# EAGLE design CertStack (EAGLE 9.5.1)
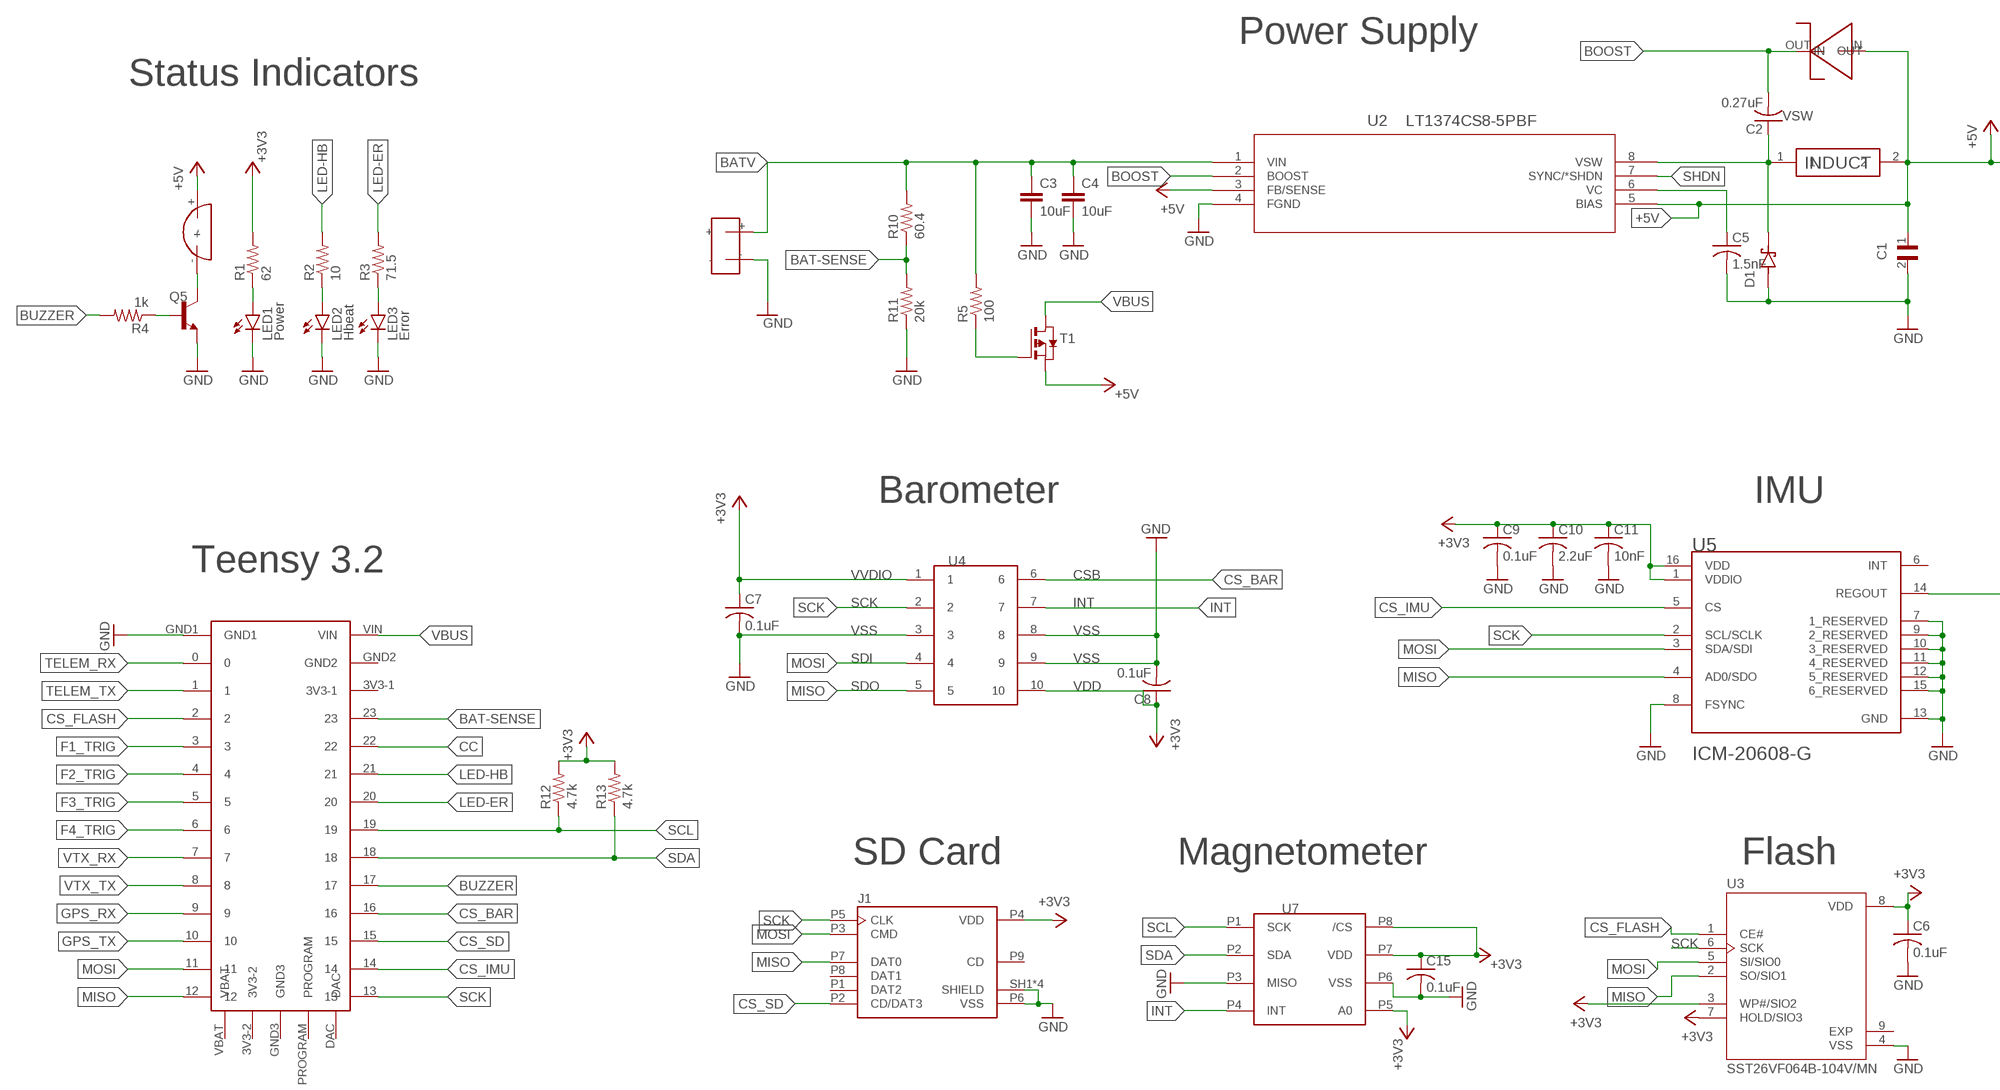
[diagram p0: schematic, sheet 1, part 1 of 2]
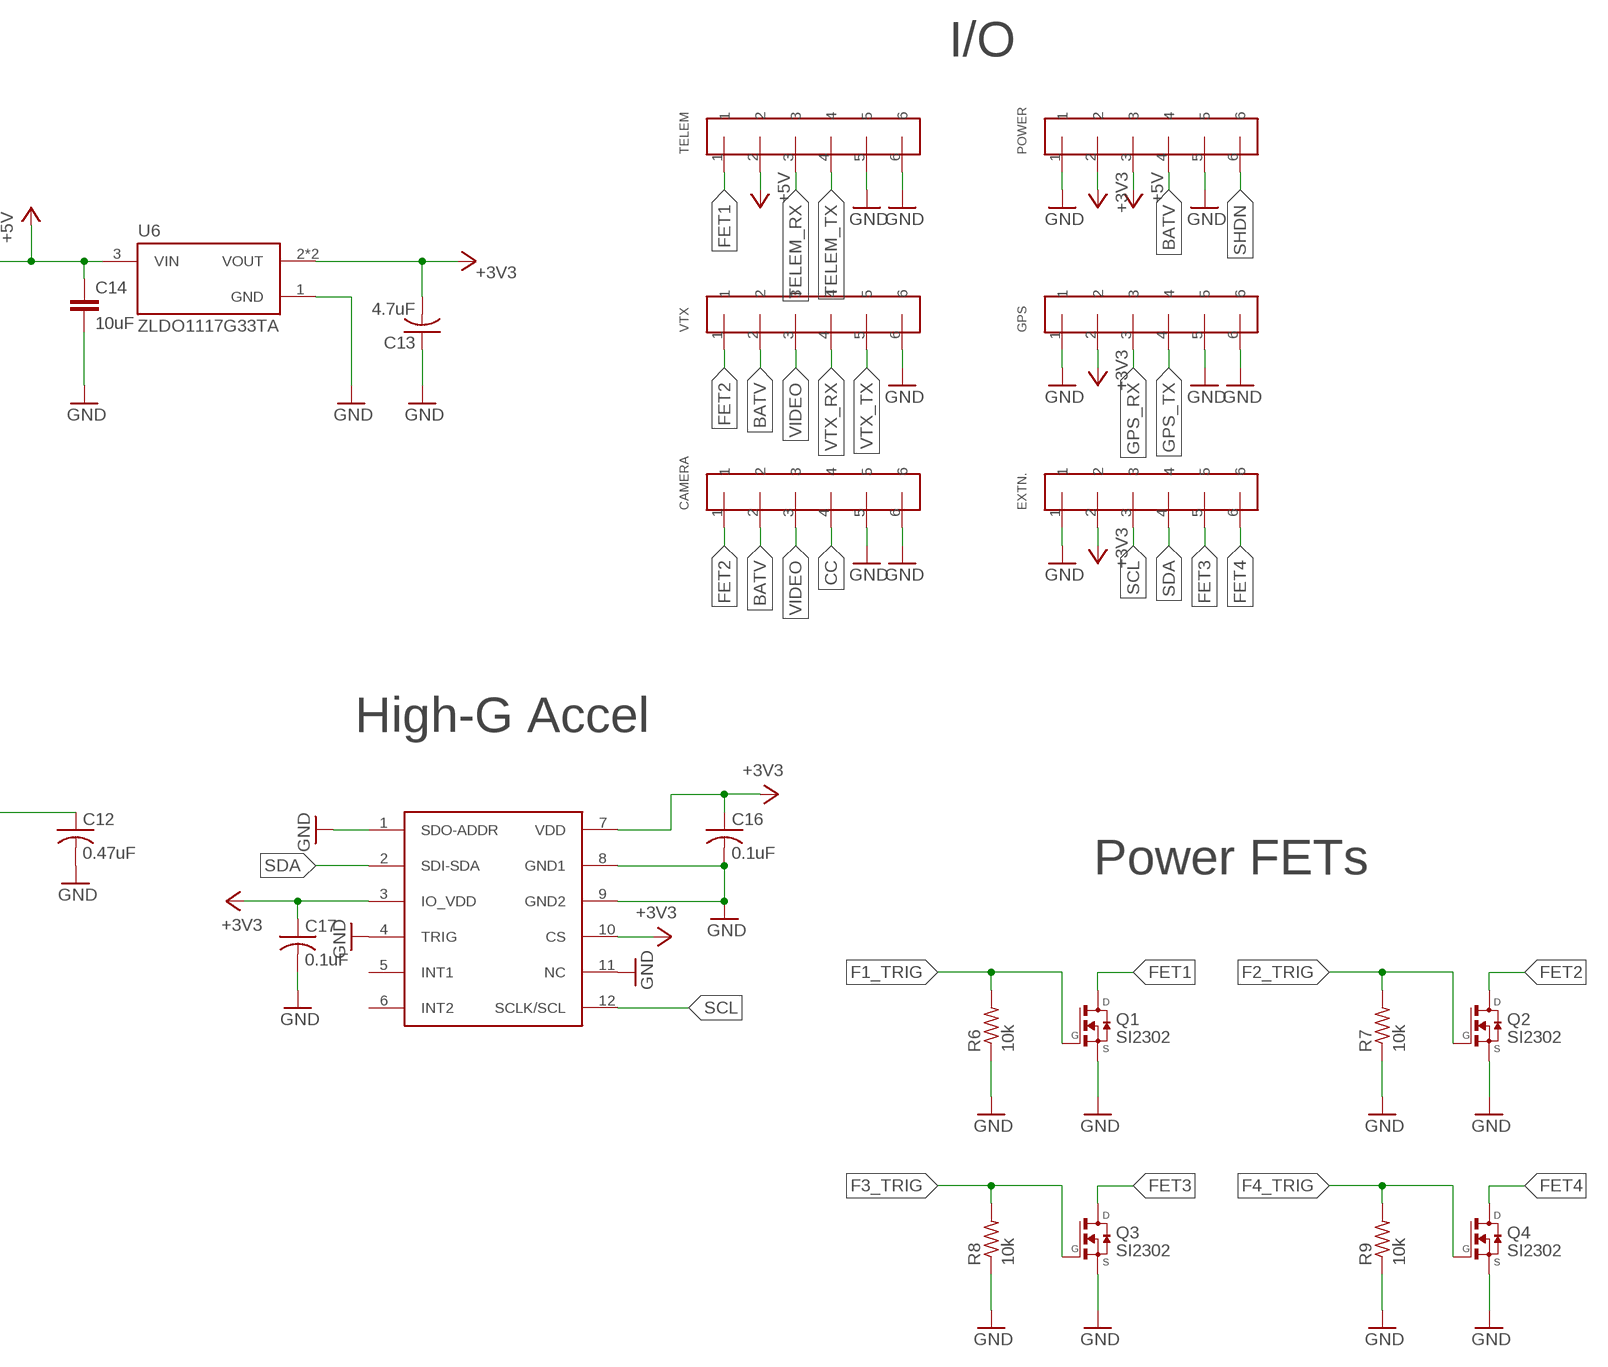
[diagram p1: schematic, sheet 1, part 2 of 2]

## Parts
BATT-CON  PWR-AWG18  [PWR-AWG18]
C1  T491X106K050AT  [CAPMP7343X430N]
C2  0.27uF  C-USC0805  [C0805]
C3  10uF  10UF-1206-6.3V-20%  [1206]
C4  10uF  10UF-1206-6.3V-20%  [1206]
C5  1.5nF  C-USC0805  [C0805]
C6  0.1uF  C-USC0805  [C0805]
C7  0.1uF  C-USC0805  [C0805]
C8  0.1uF  C-USC0805  [C0805]
C9  0.1uF  C-USC0805  [C0805]
C10  2.2uF  C-USC0805  [C0805]
C11  10nF  C-USC0805  [C0805]
C12  0.47uF  C-USC0805  [C0805]
C13  4.7uF  C-USC0805  [C0805]
C14  10uF  10UF-1206-6.3V-20%  [1206]
C15  0.1uF  C-USC0805  [C0805]
C16  0.1uF  C-USC0805  [C0805]
C17  0.1uF  C-USC0805  [C0805]
CAMERA  JST-PH-6  [JST-PH-6]
D1  PMEG4020ETP,115  [SODFL4725X110N]
D2  DO-214AB  [DO-214AB]
EXTN.  JST-PH-6  [JST-PH-6]
GPS  JST-PH-6  [JST-PH-6]
J1  MEM2075-00-140-01-A  [GCT_MEM2075-00-140-01-A]
L1  IHLP3232DZER6R8M11  [IHLP3232DZER6R8M11]
LED1  Power  LEDSML0805  [SML0805]
LED2  Hbeat  LEDSML0805  [SML0805]
LED3  Error  LEDSML0805  [SML0805]
LS1  CMT-8540S  [CMT-8540S]
POWER  JST-PH-6  [JST-PH-6]
Q1  SI2302  [SOT23]
Q2  SI2302  [SOT23]
Q3  SI2302  [SOT23]
Q4  SI2302  [SOT23]
Q5  MMBT2222A  [SOT23]
R1  62  R-US_R0805  [R0805]
R2  10  R-US_R0805  [R0805]
R3  71.5  R-US_R0805  [R0805]
R4  1k  R-US_R0805  [R0805]
R5  100  R-US_R0805  [R0805]
R6  10k  R-US_R0805  [R0805]
R7  10k  R-US_R0805  [R0805]
R8  10k  R-US_R0805  [R0805]
R9  10k  R-US_R0805  [R0805]
R10  60.4  R-US_R0805  [R0805]
R11  20k  R-US_R0805  [R0805]
R12  4.7k  R-US_R0805  [R0805]
R13  4.7k  R-US_R0805  [R0805]
T1  DMP3098L-7  PMOSSOT23  [SOT-23]
TELEM  JST-PH-6  [JST-PH-6]
U1  TEENSY-32  [TEENSY-32]
U2  LT1374CS8-5PBF  [SO-8_S]
U3  SST26VF064B-104V/MN  [SON127P600X800X80-9N]
U4  BMP384  [PQFN45P200X200X100-10N]
U5  INVENSENSE_ICM-20608-GINVENSENSE_ICM-20608-G_0_0  [INVENSENSE_ICM-20608-G_0]
U6  ZLDO1117G33TA  [SOT230P700X180-4N]
U7  MLX90395KDCMLX90395  [MLX90395KDC_FPRT]
U8  KIONIX_KXTJ3-1057  [KIONIX_KXTJ3-1057]
VTX  JST-PH-6  [JST-PH-6]

## Nets
+3V3: C6.1 C7.1 C8.1 C9.1 C10.1 C11.1 C13.2 C15.1 C16.1 C17.1 EXTN..2 GPS.2 J1.P4(VDD) POWER.2 R1.2 R12.2 R13.2 U3.3(WP#/SIO2) U3.7(HOLD/SIO3) U3.8(VDD) U4.1 U4.10 U5.1(VDDIO) U5.16(VDD) U6.2(VOUT) U6.4(VOUT) U7.P5(A0) U7.P7(VDD) U7.P8(/CS) U8.3(IO_VDD) U8.7(VDD) U8.10(CS)
+5V: C1.1 C14.1 D2.IN L1.2 LS1.+ POWER.3 T1.2(S) TELEM.2 U2.3(FB/SENSE) U2.5(BIAS) U6.3(VIN)
BAT-SENSE: R10.1 R11.2 U1.23
BATV: BATT-CON.+ C3.1 C4.1 CAMERA.2 POWER.4 R5.2 R10.2 U2.1(VIN) VTX.2
BOOST: C2.2 D2.OUT U2.2(BOOST)
BUZZER: R4.2 U1.17
CC: CAMERA.4 U1.22
CS_BAR: U1.16 U4.6
CS_FLASH: U1.2 U3.1(CE#)
CS_IMU: U1.14 U5.5(CS)
CS_SD: J1.P2(CD/DAT3) U1.15
F1_TRIG: Q1.1(G) R6.2 U1.3
F2_TRIG: Q2.1(G) R7.2 U1.4
F3_TRIG: Q3.1(G) R8.2 U1.5
F4_TRIG: Q4.1(G) R9.2 U1.6
FET1: Q1.3(D) TELEM.1
FET2: CAMERA.1 Q2.3(D) VTX.1
FET3: EXTN..5 Q3.3(D)
FET4: EXTN..6 Q4.3(D)
GND: BATT-CON.- C1.2 C3.2 C4.2 C5.2 C6.2 C7.2 C8.2 C9.2 C10.2 C11.2 C12.2 C13.1 C14.2 C15.2 C16.2 C17.2 CAMERA.5 CAMERA.6 D1.2(A) EXTN..1 GPS.1 GPS.5 GPS.6 J1.P6(VSS) J1.SH1(SHIELD) J1.SH2(SHIELD) J1.SH3(SHIELD) J1.SH4(SHIELD) LED1.C LED2.C LED3.C POWER.1 POWER.5 Q1.2(S) Q2.2(S) Q3.2(S) Q4.2(S) Q5.2(E) R6.1 R7.1 R8.1 R9.1 R11.1 TELEM.5 TELEM.6 U1.GND1 U2.4(FGND) U3.4(VSS) U4.3 U4.8 U4.9 U5.7(1_RESERVED) U5.8(FSYNC) U5.9(2_RESERVED) U5.10(3_RESERVED) U5.11(4_RESERVED) U5.12(5_RESERVED) U5.13(GND) U5.15(6_RESERVED) U6.1(GND) U7.P3(MISO) U7.P6(VSS) U8.1(SDO-ADDR) U8.4(TRIG) U8.8(GND1) U8.9(GND2) U8.11(NC) VTX.6
GPS_RX: GPS.3 U1.9
GPS_TX: GPS.4 U1.10
INT: U4.7
LED-ER: R3.2 U1.20
LED-HB: R2.2 U1.21
MISO: J1.P7(DAT0) U1.12 U3.2(SO/SIO1) U4.5 U5.4(AD0/SDO)
MOSI: J1.P3(CMD) U1.11 U3.5(SI/SIO0) U4.4 U5.3(SDA/SDI)
N$4: U7.P4(INT)
N$6: LED3.A R3.1
N$7: C12.1 U5.14(REGOUT)
N$12: R5.1 T1.3(G)
N$16: LED1.A R1.1
N$17: LED2.A R2.1
N$19: LS1.- Q5.3(C)
N$22: Q5.1(B) R4.1
SCK: J1.P5(CLK) U1.13 U3.6(SCK) U4.2 U5.2(SCL/SCLK)
SCL: EXTN..3 R12.1 U1.19 U7.P1(SCK) U8.12(SCLK/SCL)
SDA: EXTN..4 R13.1 U1.18 U7.P2(SDA) U8.2(SDI-SDA)
SHDN: POWER.6 U2.7(SYNC/*SHDN)
TELEM_RX: TELEM.3 U1.0
TELEM_TX: TELEM.4 U1.1
VBUS: T1.1(D) U1.VIN
VC: C5.1 U2.6(VC)
VIDEO: CAMERA.3 VTX.3
VSW: C2.1 D1.1(K) L1.1 U2.8(VSW)
VTX_RX: U1.7 VTX.4
VTX_TX: U1.8 VTX.5
Unconnected: J1.P1(DAT2) J1.P8(DAT1) J1.P9(CD) U1.3V3-1 U1.3V3-2 U1.DAC U1.GND2 U1.GND3 U1.PROGRAM U1.VBAT U3.9(EXP) U5.6(INT) U8.5(INT1) U8.6(INT2)

## Notes on the sheet
- I/O
- Power Supply
- Status Indicators
- Barometer | IMU
- High-G Accel
- Teensy 3.2
- Power FETs
- SD Card | Magnetometer | Flash

## Library data of the parts
BATT-CON = mylibrary:PWR-AWG18
C1 = T491X106K050AT:T491X106K050AT: SURFACE MOUNT TANTALUM Check prices <https://pricing.snapeda.com/parts/T491X106K050AT/KEMET/view-part?ref=eda>; AVAILABILITY: In Stock; DESCRIPTION: 10 µF Molded Tantalum Capacitors 50 V 2917 (7343 Metric) 700mOhm; MF: KEMET; MP: T491X106K050AT; PACKAGE: SMD-2 KEMET; PRICE: None; PURCHASE-URL: https://pricing.snapeda.com/search/part/T491X106K050AT/?ref=eda
C2 C5-C13 C15-C17 = rcl:C-US: CAPACITOR, American symbol; SPICEPREFIX: C
C3 C4 C14 = SparkFun-Capacitors:10UF: 10.0µF ceramic capacitors A capacitor is a passive two-terminal electrical component used to store electrical energy temporarily in an electric field.; PROD_ID: CAP-10057
CAMERA EXTN. GPS POWER TELEM VTX = mylibrary:JST-PH-6
D1 = PMEG4020ETP_115:PMEG4020ETP,115: Diode Schottky 40V 2A Surface Mount SOD-128/CFP5 Check prices <https://pricing.snapeda.com/parts/PMEG4020ETP%2C115/Nexperia%20USA%20Inc./view-part?ref=eda>; AVAILABILITY: In Stock; DESCRIPTION: Diode Schottky 40 V 2A Surface Mount SOD-128/CFP5; MF: Nexperia USA Inc.; MP: PMEG4020ETP,115; PACKAGE: SOD-128 Nexperia USA; PRICE: None; PURCHASE-URL: https://pricing.snapeda.com/search/part/PMEG4020ETP,115/?ref=eda
D2 = DO-214AB:DO-214AB: Check prices <https://pricing.snapeda.com/parts/DO-214AB/Littelfuse%20Inc./view-part?ref=eda>; AVAILABILITY: Not in stock; DESCRIPTION: 143.85V Clamp 11.1A Ipp Tvs Diode Surface Mount DO-214AB (SMCJ); MF: Littelfuse Inc.; MP: DO-214AB; PACKAGE: DO-214AB-214 Littelfuse Inc.; PRICE: None
J1 = MEM2075-00-140-01-A:MEM2075-00-140-01-A: Micro SD Memory Card Connector, 1.4mm Profile SMT, Push-Push, with Normally open Switch Check prices <https://snapeda.com/parts/MEM2075-00-140-01-A/Global%20Connector%20Technology/view-part/?ref=eda>; AVAILABILITY: Bad; DESCRIPTION: 9 (8 + 1) Position Card Connector microSD™ Surface Mount, Right Angle Gold; MF: Global Connector Technology; MP: MEM2075-00-140-01-A; PACKAGE: Package; PRICE: None
L1 = mylibrary:IHLP3232DZER6R8M11
LED1-LED3 = led:LED: LED OSRAM: - CHIPLED LG R971, LG N971, LY N971, LG Q971, LY Q971, LO R971, LY R971 LH N974, LH R974 LS Q976, LO Q976, LY Q976 LO Q996 - Hyper CHIPLED LW Q18S LB Q993, LB Q99A, LB R99A - SideLED LS A670, LO A670, LY A670, LG A670, LP A670 LB A673, LV A673, LT A673, LW A673 LH A674 LY A675 LS A676, LA A676, LO A676, LY A676, LW A676 LS A679, LY A679, LG A679 - Hyper Micro SIDELED® LS Y876, LA Y876, LO Y876, LY Y876 LT Y87S - SmartLED LW L88C, LW L88S LB L89C, LB L89S, LG L890 LS L89K, LO L89K, LY L89K LS L896, LA L896, LO L896, LY L896 - TOPLED LS T670, LO T670, LY T670, LG T670, LP T670 LSG T670, LSP T670, LSY T670, LOP T670, LYG T670 LG T671, LOG T671, LSG T671 LB T673, LV T673, LT T673, LW T673 LH T674 LS T676, LA T676, LO T676, LY T676, LB T676, LH T676, LSB T676, LW T676 LB T67C, LV T67C, LT T67C, LS T67K, LO T67K, LY T67K, LW E67C LS E67B, LA E67B, LO E67B, LY E67B, LB E67C, LV E67C, LT E67C LW T67C LS T679, LY T679, LG T679 LS T770, LO T770, LY T770, LG T770, LP T770 LB T773, LV T773, LT T773, LW T773 LH T774 LS E675, LA E675, LY E675, LS T675 LS T776, LA T776, LO T776, LY T776, LB T776 LHGB T686 LT T68C, LB T68C - Hyper Mini TOPLED® LB M676 - Mini TOPLED Santana® LG M470 LS M47K, LO M47K, LY M47K Source: http://www.osram.convergy.de LUXEON: - LUMILED® LXK2-PW12-R00, LXK2-PW12-S00, LXK2-PW14-U00, LXK2-PW14-V00 LXK2-PM12-R00, LXK2-PM12-S00, LXK2-PM14-U00 LXK2-PE12-Q00, LXK2-PE12-R00, LXK2-PE12-S00, LXK2-PE14-T00, LXK2-PE14-U00 LXK2-PB12-K00, LXK2-PB12-L00, LXK2-PB12-M00, LXK2-PB14-N00, LXK2-PB14-P00, LXK2-PB14-Q00 LXK2-PR12-L00, LXK2-PR12-M00, LXK2-PR14-Q00, LXK2-PR14-R00 LXK2-PD12-Q00, LXK2-PD12-R00, LXK2-PD12-S00 LXK2-PH12-R00, LXK2-PH12-S00 LXK2-PL12-P00, LXK2-PL12-Q00, LXK2-PL12-R00 Source: www.luxeon.com KINGBRIGHT: KA-3528ASYC Source: www.kingbright.com
LS1 = mylibrary:CMT-8540S
Q1-Q4 = SI2302:SI2302: MOSFET N-Channel 20 V (D-S) Check prices <https://pricing.snapeda.com/parts/SI2302/Vishay%20Siliconix/view-part?ref=eda>; AVAILABILITY: In Stock; DESCRIPTION: N-Channel 20 V 2.1A (Ta) 700mW (Ta) Surface Mount SOT-23-3 (TO-236); MF: Vishay Siliconix; MP: SI2302; PACKAGE: SOT-23-3 Vishay Siliconix; PRICE: None; PURCHASE-URL: https://pricing.snapeda.com/search/part/SI2302/?ref=eda
Q5 = MMBT2222A:MMBT2222A: 2N2222 General Purpose NPN Transistor; AVAILABILITY: Unavailable; DESCRIPTION: MMBT2222 Series 40 V CE Breakdown 1 A NPN General Purpose Amplifier - SOT-23; MF: Fairchild Semiconductor; MP: MMBT2222A.; PACKAGE: SOT-23 Fairchild Semiconductor; PRICE: None
R1-R13 = rcl:R-US_: RESISTOR, American symbol; SPICEPREFIX: R
T1 = zetex:PMOSSOT23: MOS FET; OC_FARNELL: unknown; OC_NEWARK: unknown
U1 = mylibrary:TEENSY-32
U2 = LT1374CS8-5PBF:LT1374CS8-5PBF: Check prices <https://pricing.snapeda.com/parts/LT1374CS8-5%23PBF/Analog%20Devices/view-part?ref=eda>; AVAILABILITY: In Stock; DESCRIPTION: Buck, SEPIC Switching Regulator IC Positive Fixed 5V 1 Output 4.5A (Switch) 8-SOIC (0.154, 3.90mm Width); MF: Analog Devices; MP: LT1374CS8-5#PBF; PACKAGE: SOIC -8 Analog Devices; PRICE: None; PURCHASE-URL: https://pricing.snapeda.com/search/part/LT1374CS8-5#PBF/?ref=eda
U3 = SST26VF064B-104V_MN:SST26VF064B-104V/MN: Flash Serial 2.5V/3V 64Mbit 64M x 1bit 8ns 8-Pin WDFN EP Tray Check prices <https://pricing.snapeda.com/parts/SST26VF064B-104V/MN/Microchip/view-part?ref=eda>; AVAILABILITY: In Stock; DESCRIPTION: FLASH Memory IC 64Mb (8M x 8) SPI - Quad I/O 104MHz 8-WDFN (6x8); MF: Microchip; MP: SST26VF064B-104V/MN; PACKAGE: WDFN-8 Microchip; PRICE: None; PURCHASE-URL: https://pricing.snapeda.com/search/part/SST26VF064B-104V/MN/?ref=eda
U4 = PQFN45P200X200X100-10N:BMP384
U5 = InvenSense - ICM-20608-G:INVENSENSE_ICM-20608-G: 6-Axis Motion Tracking Device 16-Pin LGA; AMBIENT_TEMPERATURE_RANGE_HIGH: +85°C; AMBIENT_TEMPERATURE_RANGE_LOW: -40°C; CENTROID_NOT_SPECIFIED: No; DATASHEET: https://www.invensense.com/wp-content/uploads/2015/03/DS-000081-v1.01.pdf; DEVICE_CLASS_L1: Sensors; DEVICE_CLASS_L2: Motion Sensors; DEVICE_CLASS_L3: Inertial Measurement Units (IMUs); DIGIKEY_DESCRIPTION: IC IMU ACCEL/GYRO I2C/SPI 16LGA; DIGIKEY_PART_NUMBER: 1428-1052-1-ND; HEIGHT: 0.8mm; LEAD_FREE: yes; MAX_SUPPLY_VOLTAGE: 3.45V; MF: InvenSense; MFG_PACKAGE_IDENT: LGA16; MFG_PACKAGE_IDENT_DATE: 0; MFG_PACKAGE_IDENT_REV: 0; MIN_SUPPLY_VOLTAGE: 1.71V; MOUSER_PART_NUMBER: 410-ICM-20608-G; MPN: ICM-20608-G; OPERATING_SUPPLY_CURRENT: 6-3000uA; PACKAGE: LGA16; PREFIX: U; ROHS: yes; SENSOR_OUTPUT: I2C,SPI; SENSOR_TYPE: Accelerometer,Gyroscope; TEMPERATURE_RANGE_HIGH: +85°C; TEMPERATURE_RANGE_LOW: -40°C; VERIFICATION_VERSION: 0.0.0.1
U6 = ZLDO1117G33TA:ZLDO1117G33TA: Linear Voltage Regulator IC Positive Fixed 1 Output 1A SOT-223-3 Check prices <https://pricing.snapeda.com/parts/ZLDO1117G33TA/Diodes%20Inc./view-part?ref=eda>; AVAILABILITY: In Stock; DESCRIPTION: Linear Voltage Regulator IC Positive Fixed 1 Output 1A SOT-223-3; MF: Diodes Inc.; MP: ZLDO1117G33TA; PACKAGE: SOT-223 Diodes Inc.; PRICE: None; PURCHASE-URL: https://pricing.snapeda.com/search/part/ZLDO1117G33TA/?ref=eda
U7 = MLX90395KDC:MLX90395KDC
U8 = KIONIX_KXTJ3-1057:KIONIX_KXTJ3-1057

## Board
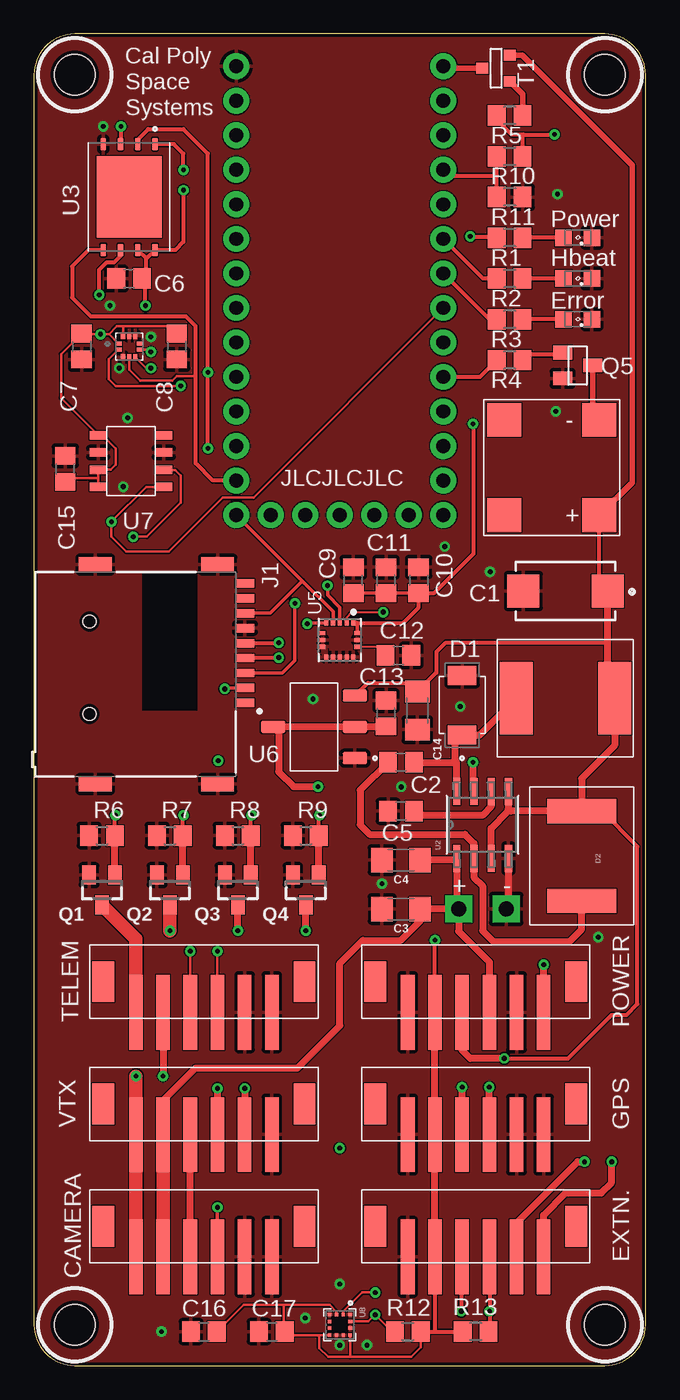
[diagram p2: board, top side]
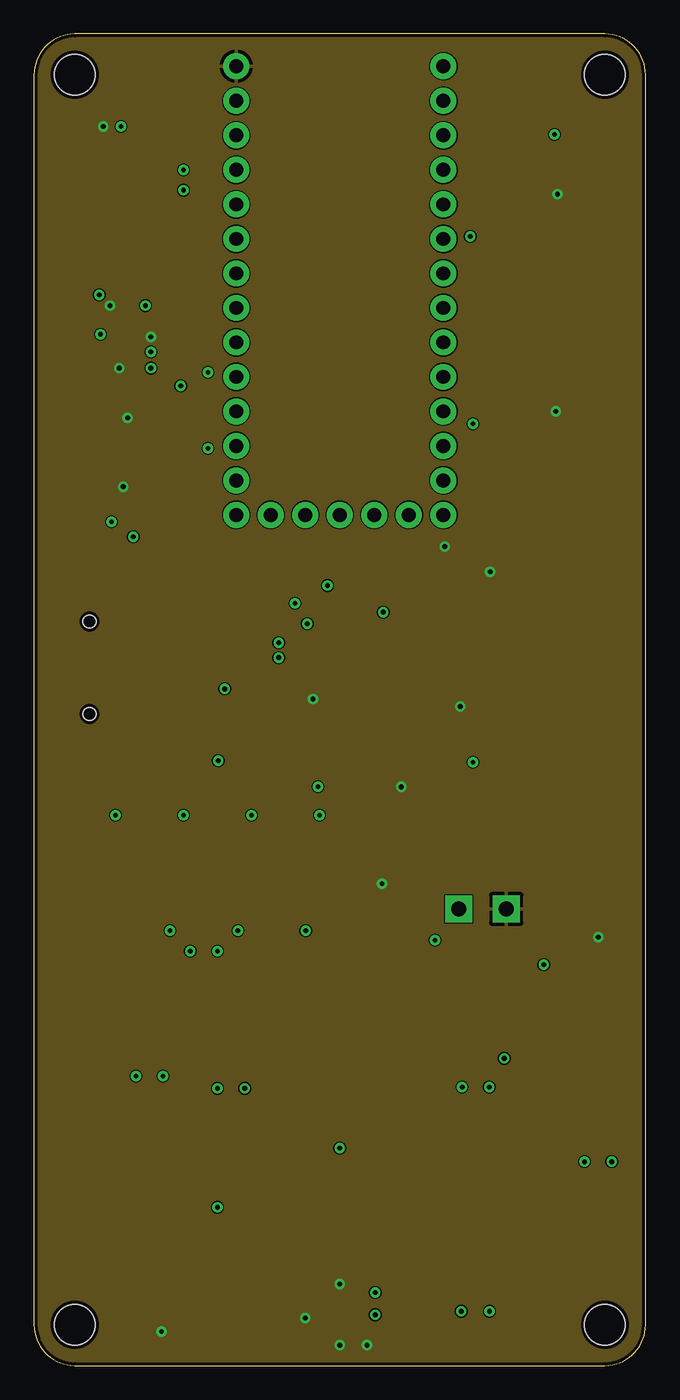
[diagram p3: board, inner layer Route2]
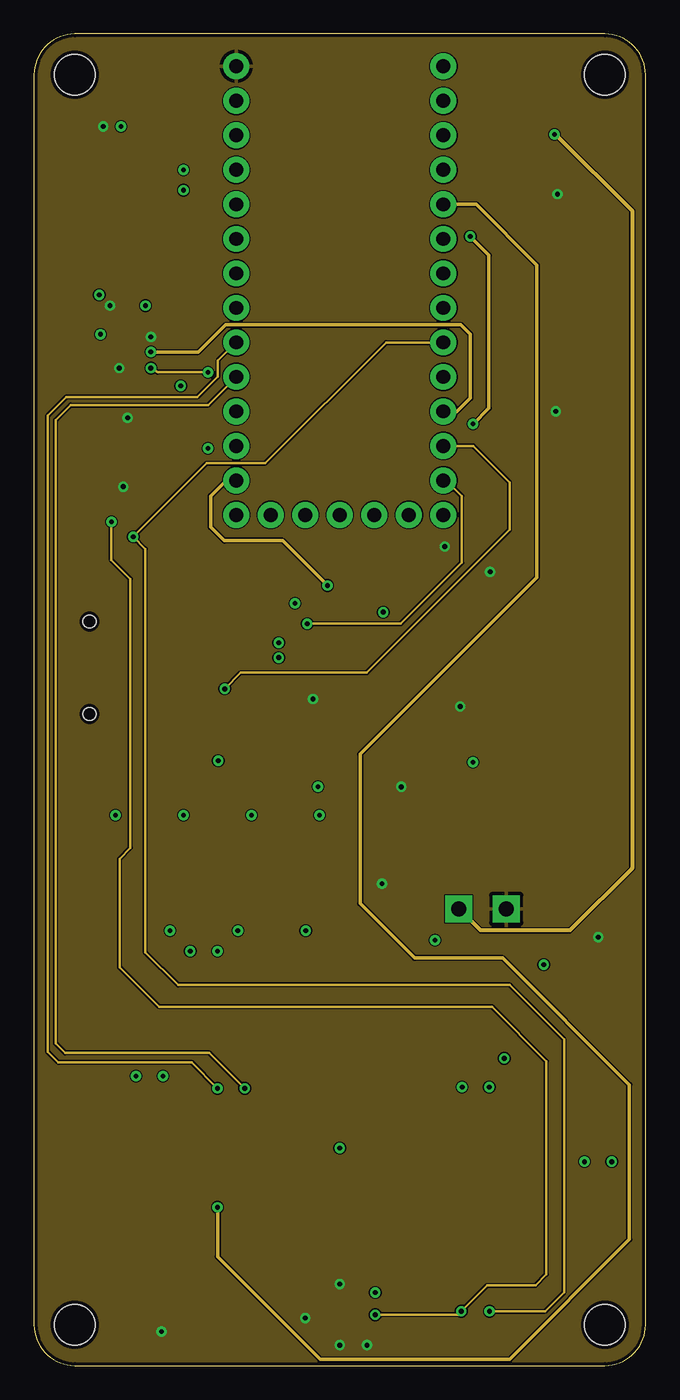
[diagram p4: board, inner layer Route15]
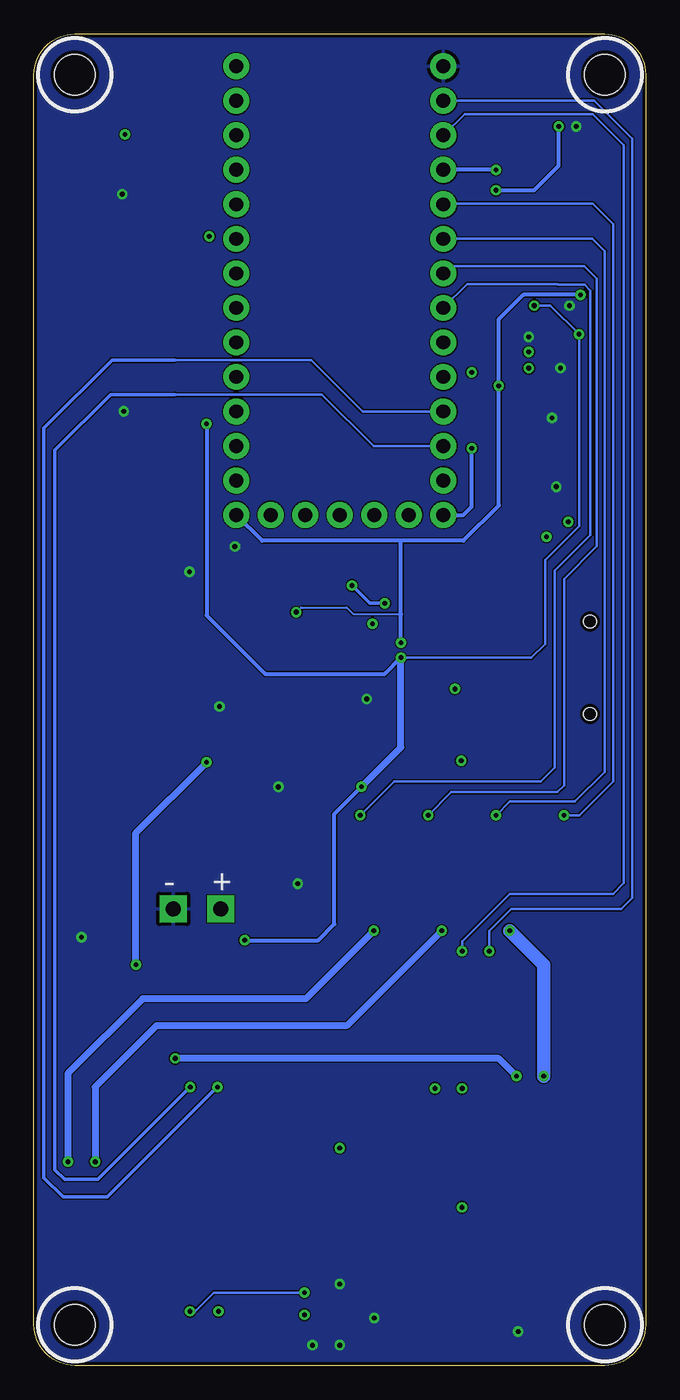
[diagram p5: board, bottom side, seen from below]

Size 45 x 98 mm. Coordinates in mm from the lower left corner, seen from the top.
Outline: 42,98 3,98 arc90 0,95 0,3 arc90 3,0 42,0 arc90 45,3 45,95 arc90 42,98
Copper layers (1*2*15*16): Top 0.035mm / dielectric 0.498mm / Route2 0.017mm / dielectric 0.5mm / Route15 0.017mm / dielectric 0.498mm / Bottom 0.035mm
Design rules "default *": minimum track width 6mil, minimum drill 0.35mm, track to track 0.09mm, track to pad 0.2mm, pad to pad 5mil, via to via 10mil, smd to smd 5mil, copper to edge 10mil, drill to drill 6mil, minimum pad ring 10mil, minimum via ring 8mil, stop-mask expansion 4mil, vias tented up to drill 0mil, thermal gap 10mil
Holes 3 mm at 3,95 42,95 42,3 3,3

### Footprints (pad centres in the part's own frame; a part is rotated, then mirrored left to right if it is on the bottom)
PWR-AWG18 = drill 1.1 pad 2 square: + -1.75,0; - 1.75,0
CAPMP7343X430N = smd 2.35 x 2.45: 1 -3.1,0; 2 3.1,0
C0805 = smd 1.3 x 1.5: 1 -0.95,0; 2 0.95,0
1206 = smd 1.6 x 1.8: 1 -1.4,0; 2 1.4,0
JST-PH-6 = smd 1 x 5.5: 1 -5,0; 2 -3,0; 3 -1,0; 4 1,0; 5 3,0; 6 5,0 | smd 1.6 x 3: A -7.4,2.25; B 7.4,2.25
SODFL4725X110N = smd 1.4 x 2.1: 1 -2.2,0; 2 2.2,0
DO-214AB = smd 1.778 x 5.08: IN -3.302,0; OUT 3.302,0
GCT_MEM2075-00-140-01-A = smd 0.62 x 1.4: P1 2.58,11.42; P2 1.48,11.42; P3 0.38,11.42; P4 -0.72,11.42; P5 -1.82,11.42; P6 -2.92,11.42; P7 -4.02,11.42; P8 -5.12,11.42; P9 -6.22,11.42 | smd 1.1 x 2.4: SH1 -7.6,0.42; SH2 -7.6,9.42; SH3 8.55,9.42; SH4 8.55,0.42 | hole 0.95: -3.4,0; 3.4,0
IHLP3232DZER6R8M11 = smd 2.413 x 5.334: 1 -3.619,0; 2 3.619,0
SML0805 = smd 1.2 x 1.2: A 1.05,0; C -1.05,0
CMT-8540S = smd 2.5 x 2.5: + 3.5,-3.5; - 3.5,3.5; NC1 -3.5,3.5; NC2 -3.5,-3.5
SOT23 = smd 1 x 1.4: 1 -0.95,-1.1; 2 0.95,-1.1; 3 0,1.1
R0805 = smd 1.3 x 1.5: 1 -0.95,0; 2 0.95,0
SOT-23 = smd 0.787 x 0.889: 1 0.025,-1.016; 2 -0.94,1.016; 3 0.991,1.016
TEENSY-32 = drill 1.016 pad 1.905: 0 -7.62,5.08; 1 -7.62,2.54; 2 -7.62,0; 3 -7.62,-2.54; 3V3-1 7.62,2.54; 3V3-2 -2.54,-25.4; 4 -7.62,-5.08; 5 -7.62,-7.62; 6 -7.62,-10.16; 7 -7.62,-12.7; 8 -7.62,-15.24; 9 -7.62,-17.78; 10 -7.62,-20.32; 11 -7.62,-22.86; 12 -7.62,-25.4; 13 7.62,-25.4; 14 7.62,-22.86; 15 7.62,-20.32; 16 7.62,-17.78; 17 7.62,-15.24; 18 7.62,-12.7; 19 7.62,-10.16; 20 7.62,-7.62; 21 7.62,-5.08; 22 7.62,-2.54; 23 7.62,0; DAC 5.08,-25.4; GND1 -7.62,7.62; GND2 7.62,5.08; GND3 0,-25.4; PROGRAM 2.54,-25.4; VBAT -5.08,-25.4; VIN 7.62,7.62
SO-8_S = smd 1.981 x 0.533: 1 -2.464,1.905; 2 -2.464,0.635; 3 -2.464,-0.635; 4 -2.464,-1.905; 5 2.464,-1.905; 6 2.464,-0.635; 7 2.464,0.635; 8 2.464,1.905
SON127P600X800X80-9N = smd 0.91 x 0.42: 1 -3.9,1.905; 2 -3.9,0.635; 3 -3.9,-0.635; 4 -3.9,-1.905; 5 3.9,-1.905; 6 3.9,-0.635; 7 3.9,0.635; 8 3.9,1.905 | smd 6 x 4.8: 9 0,0
PQFN45P200X200X100-10N = smd 0.3 x 0.46: 1 0.225,0.785; 2 -0.225,0.785; 6 -0.225,-0.785; 7 0.225,-0.785 | smd 0.46 x 0.3: 3 -0.785,0.45; 4 -0.785,0; 5 -0.785,-0.45; 8 0.785,-0.45; 9 0.785,0; 10 0.785,0.45
INVENSENSE_ICM-20608-G_0 = smd 0.4 x 0.3: 1 -1.265,1; 2 -1.265,0.5; 3 -1.265,0; 4 -1.265,-0.5; 5 -1.265,-1; 9 1.265,-1; 10 1.265,-0.5; 11 1.265,0; 12 1.265,0.5; 13 1.265,1 | smd 0.3 x 0.4: 6 -0.5,-1.265; 7 0,-1.265; 8 0.5,-1.265; 14 0.5,1.265; 15 0,1.265; 16 -0.5,1.265
SOT230P700X180-4N = smd 1.81 x 0.89: 1 -3.01,2.3; 2 -3.01,0; 3 -3.01,-2.3; 4 3.01,0
MLX90395KDC_FPRT = smd 1.27 x 0.635: P1 -2.54,2.54; P2 -2.54,1.27; P3 -2.54,0; P4 -2.54,-1.27; P5 2.265,-1.27; P6 2.265,0; P7 2.265,1.27; P8 2.265,2.54
KIONIX_KXTJ3-1057 = smd 0.275 x 0.25: 1 -0.762,0.75; 2 -0.762,0.25; 3 -0.762,-0.25; 4 -0.762,-0.75; 7 0.762,-0.75; 8 0.762,-0.25; 9 0.762,0.25; 10 0.762,0.75 | smd 0.25 x 0.275: 5 -0.25,-0.762; 6 0.25,-0.762; 11 0.25,0.762; 12 -0.25,0.762

### Placement (x,y rotation side)
BATT-CON  33,33.6 0 top
C1  39.1,57 180 top
C2  27,44.4 180 top
C3  27,33.6 180 top
C4  27,37.2 180 top
C5  27,40.8 180 top
C6  7,80 180 top
C7  3.5,75 270 top
C8  10.5,75 270 top
C9  23.5,57.8 90 top
C10  28.3,57.81 90 top
C11  25.9,57.8 90 top
C12  26.81,52.27 0 top
C13  25.9,48 270 top
C14  28.2,48.2 270 top
C15  2.3,66 90 top
C16  12.5,2.5 180 top
C17  17.5,2.5 180 top
CAMERA  12.5,8 0 top
D1  31.5,48.6 90 top
D2  40.3,37.5 270 top
EXTN.  32.5,8 0 top
GPS  32.5,17 0 top
J1  4.09,51.35 270 top
L1  39.1,49.1 0 top
LED1  40,83 180 top
LED2  40,80 180 top
LED3  40,77 180 top
LS1  38.1,66.1 0 top
POWER  32.5,26 0 top
Q1  5,35 180 top
Q2  10,35 180 top
Q3  15,35 180 top
Q4  20,35 180 top
Q5  40,73.6 270 top
R1  35,83 180 top
R2  35,80 180 top
R3  35,77 180 top
R4  35,74 180 top
R5  35,92 180 top
R6  5,39 0 top
R7  10,39 0 top
R8  15,39 0 top
R9  20,39 0 top
R10  35,89 0 top
R11  35,86 180 top
R12  27.5,2.5 0 top
R13  32.5,2.5 180 top
T1  34,95.5 270 top
TELEM  12.5,26 0 top
U1  22.5,88 0 top
U2  33,39.8 90 top
U3  7,86 270 top
U4  7,75 90 top
U5  22.5,53.4 270 top
U6  20.6,47 180 top
U7  7,67.2 180 top
U8  22.5,3 270 top
VTX  12.5,17 0 top

### Tracks (layer width: path | path; a pad name or v marks a point on that pad's centre or on a via)
+3V3  (via drill 0.35)
  Top 0.2: U4.1 5.54,75.9 | 5.54,75.9 5.52,75.92 6.1,76.5 6.5,76.5 | C8.1 9.95,76.5 6.5,76.5 | 5.54,75.9 v4.9,75.9 3.55,75.9 C7.1 2,74.45 2,71.2 U7.P5 5.03,68.47 6,67.5 6,66.3 5.63,65.93 U7.P7 4.74,65.3 | U4.10 6.55,76.45 6.5,76.5 | 4.74,65.3 U7.P8 | C15.1 2.55,65.3 4.74,65.3 | U8.7 21,2.24 | 19.01,2.24 18.39,2.24 18.39,4.47 | 21,2.24 19.01,2.24 | 19.01,2.24 C17.1 | U8.3 22.25,3.97 21.75,4.47 18.39,4.47 | 18.39,4.47 15.42,4.47 C16.1 | R12.2 28.45,1.34 27.74,0.63 23.24,0.63 | 21,2.24 21,1.28 21.65,0.63 23.24,0.63 | U8.10 23.25,0.64 23.24,0.63
  Top 0.25: C9.1 23.55,56.86 C11.1 C10.1 | U5.16 23.77,54.64 23.74,54.66
  Top 0.3: v6.4,91.2 6.4,89.94 U3.3 | U3.7 8.25,81.48 | 8.25,81.48 8.25,80.3 C6.1 8.2,79.75 v8.2,78 | 8.25,81.48 8.29,81.48 U3.8 10.4,82.1 11,82.7 v11,86.5 | v18,52.1 17.97,52.07 J1.P4 | U5.1 23.74,54.66 27.16,54.66 28.3,55.8 C10.1 29.46,56.86 32.35,59.75 32.35,69.25 v32.3,69.3 | v32.1,83.1 33.95,83.1 R1.2 | POWER.2 v29.5,31.3 | R12.2 29.52,2.5 | 29.52,2.5 R13.2 | EXTN..2 29.5,2.52 29.52,2.5
  Top 0.5: EXTN..2 GPS.2 POWER.2 | C13.2 25.85,47 U6.2 U6.4 18,46.59 18,43.7 19.1,42.6 v20.9,42.6
  Route15 0.25: v32.3,69.3 33.46,70.46 33.46,81.71 32.1,83.07 v32.1,83.1
  Bottom 0.2: v8.2,78 7,78 v4.9,75.9 4.9,61.8 7.4,59.3 7.4,53.1 8.4,52.1 v18,52.1
  Bottom 0.3: v11,86.5 8.2,86.5 6.4,88.3 v6.4,91.2 | v29.5,31.3 24.1,31.3 22.9,32.5 22.9,40.6 v20.9,42.6 | v32.3,69.3 32.3,55.2 28,50.9 19.2,50.9 v18,52.1
  Bottom 0.5: v20.9,42.6 18,45.5 v18,52.1
+5V  (via drill 0.35)
  Top 0.3: C1.1 41.6,57.6 LS1.+ | U6.3 24.56,50.25 27.55,50.25 C14.1 29.6,51 29.6,52.5 30.3,53.2 40.9,53.2 42.1,53.2 42.2,53.3
  Top 0.305: v34.6,22.6 39.3,22.6 42.5,25.8 43.6,25.8 44.4,26.6 44.4,38.2 41.8,40.8 39.9,40.8
  Top 0.4: T1.2 35.92,96.44 44,88.36 44,65 LS1.+
  Top 0.5: C1.1 42.2,54.5 42.2,53.3 42.2,49.62 L1.2 42.72,45.62 40.3,43.2 D2.IN 39.9,40.8 35.1,40.8 34.91,41 | U2.3 33.63,39.53 34.91,40.8 34.91,41 | U2.5 34.91,41 | TELEM.2 v9.5,21.3 | v34.6,22.6 32.1,22.6 31.5,23.2 POWER.3
  Bottom 0.5: v9.5,21.3 10.8,22.6 v34.6,22.6
BAT-SENSE
  Top 0.3: R11.2 34.05,87.58 | 34.05,87.58 R10.1 | U1.23 30.54,87.58 34.05,87.58
BATV  (via drill 0.35)
  Top 0.3: 36,90.6 35.15,90.6 34.05,91.7 R5.2 | 36,90.6 v38.3,90.6 | R10.2 35.95,90.55 36,90.6
  Top 0.5: BATT-CON.+ 31.09,33.76 U2.1 30.96,37.2 C4.1 | BATT-CON.+ C3.1 28.4,32.7 27,31.3 24.2,31.3 22.5,29.6 22.5,25 19.4,21.9 11.9,21.9 9.5,19.5 VTX.2 | BATT-CON.+ 31.25,31.95 33.5,29.7 POWER.4
  Top 1: CAMERA.2 VTX.2
  Route15 0.3: v38.3,90.6 38.4,90.6 44,85 44,36.6 39.42,32.02 32.86,32.02 31.29,33.6 BATT-CON.+
BOOST
  Top 0.5: D2.OUT 40.3,32.1 39.4,31.2 33.8,31.2 33,32 33,35.3 32.37,35.94 U2.2 32.37,38.44 31.7,39.1 24.7,39.1 24,39.8 24,42.35 C2.2
BUZZER
  Top 0.3: R4.2 32.81,72.76 U1.17
CC  (via drill 0.35)
  Top 0.25: CAMERA.4 v13.5,11.63 v13.51,11.64
  Route15 0.25: v13.51,11.64 CAMERA.4 21.06,0.46 34.99,0.46 43.81,9.28 43.81,20.67 34.48,30 28,30 24,34 24,45 37,58 37,81 32.54,85.46 U1.22
CS_BAR  (via drill 0.35)
  Top 0.2: U4.6 8.6,74.78 v8.6,74.6
  Route15 0.25: U1.16 31.12,70.22 32.1,71.2 32.1,75.9 31.4,76.6 14.1,76.6 12.1,74.6 v8.6,74.6
CS_FLASH  (via drill 0.35)
  Top 0.3: v11,88 11,89.2 10.3,89.9 U3.1
  Bottom 0.3: v11,88 U1.2
CS_IMU  (via drill 0.35)
  Top 0.25: U5.5 20.17,54.66 v20.1,54.59
  Route15 0.2: v20.1,54.59 26.99,54.59 31.48,59.08 31.48,64 30.34,65.14 U1.14
CS_SD  (via drill 0.35)
  Top 0.25: J1.P2 14.13,49.87 14.12,49.88 v14.03,49.8
  Route15 0.2: v14.03,49.8 15.23,51 24.49,51 35,61.51 35,65 32.32,67.68 U1.15
F1_TRIG  (via drill 0.35)
  Top 0.3: R6.2 5.95,40.45 v6,40.5
  Top 0.5: Q1.1 R6.2
  Bottom 0.2: v6,40.5 4.9,40.5 2.4,43 2.4,84 3.9,85.5 14.84,85.5 U1.3
F2_TRIG  (via drill 0.35)
  Top 0.3: R7.2 10.95,40.45 v11,40.5
  Top 0.5: Q2.1 R7.2
  Bottom 0.2: v11,40.5 10,41.5 5.2,41.5 3,43.7 3,82 3.92,82.92 U1.4
F3_TRIG  (via drill 0.35)
  Top 0.3: R8.2 15.95,40.45 v16,40.5
  Top 0.5: Q3.1 R8.2
  Bottom 0.2: v16,40.5 14.3,42.2 6.5,42.2 6,42.7 6,57.9 3.6,60.3 3.6,80 4.5,80.9 14.36,80.9 U1.5
F4_TRIG  (via drill 0.35)
  Top 0.3: R9.2 20.95,40.45 v21,40.5
  Top 0.5: Q4.1 R9.2
  Bottom 0.2: v21,40.5 18.5,43 7.7,43 6.7,44 6.7,58.5 4.07,61.13 4.07,79.1 4.5,79.53 6.43,79.53 6.5,79.6 13.12,79.6 U1.6
FET1
  Top 1: Q1.3 7.5,31.4 TELEM.1
FET2  (via drill 0.35)
  Top 0.5: VTX.1 7.5,16
  Top 1: 7.5,16 CAMERA.1 | Q2.3 v10,32 | v7.5,21.3 VTX.1
  Bottom 1: v7.5,21.3 7.5,29.5 v10,32
FET3  (via drill 0.35)
  Top 0.5: v15,32 Q3.3 | EXTN..5 35.5,10.5 40,15 v40.5,15
  Bottom 0.5: v15,32 22,25 36,25 40.5,20.5 v40.5,15
FET4  (via drill 0.35)
  Top 0.5: v20,32 Q4.3 | EXTN..6 37.5,11.06 39.14,12.7 41.75,12.7 42.5,13.45 v42.5,15
  Bottom 0.5: v20,32 25,27 37,27 42.5,21.5 v42.5,15
GND  (via drill 0.35)
  Top 0.152: U4.3 6.55,74.35
  Top 0.5: U2.4 34.91,33.76 BATT-CON.-
  other vias: 5.1,91.2 6.27,73.4 5.6,78 8.6,75.7 38.51,86.21 25.6,35.46 9.38,2.5 22.5,1.5 24.5,1.5 22.5,6 19.96,3.5 31.36,48.51 33.56,58.41 38.39,70.22 6.89,69.75 6.57,64.68 30.22,60.27 20.52,49.06 27.02,42.59 41.51,31.53
  pour Top: 0,0 45,0 45,98 0,98
  pour Route2: 0,98 45,98 45,0 0,0
  pour Bottom: 0,98 45,98 45,0 0,0
  pour Route15: 0,98 45,98 45,0 0,0
GPS_RX  (via drill 0.35)
  Top 0.5: GPS.3 v31.5,20.5
  Bottom 0.2: 34.64,74.01 24.6,74.01 20.81,70.22 U1.9
  Bottom 0.25: v31.5,20.5 39.6,12.4 42.84,12.4 44.27,13.83 44.27,68.99 39.25,74.01 34.64,74.01
GPS_TX  (via drill 0.35)
  Top 0.5: GPS.4 v33.5,20.5
  Bottom 0.2: U1.10 20.02,67.68 23.81,71.47 34.64,71.47
  Bottom 0.25: v33.5,20.5 40.31,13.69 42.75,13.69 43.46,14.4 43.46,67.36 39.35,71.47 34.64,71.47
LED-ER
  Top 0.3: R3.2 33.5,77 U1.20
LED-HB
  Top 0.3: R2.2 33.04,80 U1.21
MISO  (via drill 0.35)
  Top 0.2: v8.6,73.4 8.27,73.4 U4.5
  Top 0.25: U1.12 19.74,57.74 | J1.P7 17.37,55.37 19.74,57.74 | U5.4 22,55.48 19.74,57.74
  Top 0.3: U3.2 7.63,90.23 8.4,91 11,91 12.8,89.2 v12.8,73.1 v12.8,67.5
  Route15 0.2: v12.8,73.1 9.1,73.1 v8.6,73.4
  Bottom 0.3: v12.8,67.5 12.8,63.2 13.4,62.6 U1.12
MOSI  (via drill 0.35)
  Top 0.2: U4.4 7,73.3 7.8,72.5 10.16,72.5 10.5,72.83 11.83,72.83 11.9,72.9
  Top 0.25: J1.P3 18.27,50.97 19.2,51.9 v19.2,56.1 | v21.6,57.4 v21.61,57.4 21.61,56.69 22.5,55.8 U5.3
  Top 0.3: U1.11 13.16,65.14 11.9,66.4 11.9,72.9 11.9,76.5 11.2,77.2 4.2,77.2 2.8,78.6 2.8,80.9 4,82.1 U3.5
  Route15 0.25: v21.6,57.4 18.3,60.7 14,60.7 13,61.7 13,64 14.14,65.14 U1.11
  Bottom 0.25: v21.6,57.4 20.3,56.1 v19.2,56.1
N$1  (via drill 0.35)
  other vias: 13.56,44.51
N$2  (via drill 0.35)
  other vias: 22.5,16
N$6
  Top 0.3: LED3.A R3.1
N$7
  Top 0.152: U5.14 25.23,52.9 C12.1
N$12
  Top 0.4: T1.3 35.95,93.58 R5.1
N$16
  Top 0.3: LED1.A R1.1
N$17
  Top 0.3: LED2.A R2.1
N$19
  Top 0.2: LS1.- 41.1,70.1
  Top 0.4: 41.1,70.1 Q5.3
N$22
  Top 0.3: Q5.1 38.75,74.4 36.35,74.4 R4.1
SCK  (via drill 0.35)
  Top 0.152: U5.2 22.99,55.05 23.39,55.45 v25.7,55.45
  Top 0.2: U4.2 5.5,74.06 5.5,72.6 6,72.1 v10.8,72.1
  Top 0.3: J1.P5 17.97,53.17 v18,53.2 | U3.6 6.37,81.67 5.9,81.2 5.36,81.2 4.8,80.64 v4.8,78.8
  Bottom 0.152: v25.7,55.45 25.35,55.8 22,55.8 21.5,55.3 18,55.3
  Bottom 0.3: v4.8,78.8 9,78.8 10.8,77 v10.8,72.1 10.8,63.3 13.4,60.7 18,60.7 | 18,60.7 28.22,60.7 U1.13 | v18,53.2 18,55.3 18,60.7
SCL  (via drill 0.35)
  Top 0.2: U7.P1 8.26,64.66 v5.7,62.1 5.7,61 6.8,59.9 9.9,59.9 13.87,63.87 16.15,63.87 U1.19 | U8.12 24.61,3.25 v25.1,3.74 26.34,2.5 R12.1
  Top 0.3: EXTN..3 31.43,7.93 v31.43,4
  Route15 0.2: v5.7,62.1 5.7,59.3 7.1,57.9 7.1,38.1 6.3,37.3 6.3,29.3 9.2,26.4 33.7,26.4 37.7,22.4 37.7,6.7 36.9,5.9 33.33,5.9 v31.43,4 31.17,3.74 v25.1,3.74
SDA  (via drill 0.35)
  Top 0.152: U7.P2 9.57,65.9
  Top 0.2: 9.57,65.9 10.4,65.9 10.8,65.5 10.8,63.5 8.3,61 v7.3,61 | U8.2 22.75,3.99 24.14,5.38 v25.1,5.38
  Top 0.3: EXTN..4 33.52,7.98 v33.52,4 33.52,2.19 R13.1
  Route15 0.2: v33.52,4 37.6,4 39,5.4 39,24 35,28 10.6,28 8.2,30.4 8.2,60.1 v7.3,61 12.7,66.4 17.01,66.4 25.91,75.3 U1.18
  Bottom 0.2: v33.52,4 33.15,4 31.78,5.37 v25.1,5.37 v25.1,5.38
SHDN  (via drill 0.35)
  Top 0.5: U2.7 32.3,42.33 v32.3,44.4 | POWER.6 v37.5,29.5
  Bottom 0.5: v37.5,29.5 37.5,39.2 v32.3,44.4
TELEM_RX  (via drill 0.35)
  Top 0.2: TELEM.3 v11.5,30.5
  Bottom 0.2: v11.5,30.5 11.5,32 9.9,33.6 1.8,33.6 1,34.4 1,90.3 3.78,93.08 U1.0
TELEM_TX  (via drill 0.35)
  Top 0.2: TELEM.4 v13.5,30.5
  Bottom 0.2: v13.5,30.5 13.5,31.2 10,34.7 2.4,34.7 1.6,35.5 1.6,89.8 3.9,92.1 13.32,92.1 U1.1
VBUS
  Top 0.4: T1.1 30.27,95.47 U1.VIN
VC
  Top 0.5: U2.6 33.63,41.13 33,40.5 28.25,40.5 C5.1
VIDEO
  Top 0.5: CAMERA.3 VTX.3
VSW
  Top 0.5: U2.8 31.09,44.4 31,44.4 | C2.1 31,44.4 | 31,44.4 31,45.9 D1.1 32.78,46.4 L1.1
VTX_RX  (via drill 0.35)
  Top 0.5: v13.5,20.4 VTX.4
  Route15 0.2: v13.5,20.4 11.6,22.3 1.8,22.3 1,23.1 1,69.9 2.39,71.29 12.03,71.29 13.53,72.8 13.53,73.95 U1.7
VTX_TX  (via drill 0.35)
  Top 0.5: v15.5,20.4 VTX.5
  Route15 0.2: v15.5,20.4 12.9,23 2.3,23 1.6,23.7 1.6,69.6 2.7,70.7 12.82,70.7 U1.8

### Text on the board
tNames: Cal Poly | Space | Systems | JLCJLCJLC
bNames: + | -